# Altium schematic sheet [2]-Power Budget.SchDoc
size A2
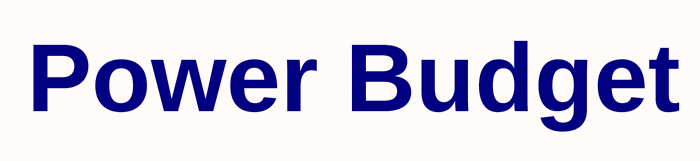
[diagram p0: [2]-Power Budget.SchDoc]

## Notes on the sheet
- Power Budget